# EAGLE schematic przekaznik (EAGLE 7.7.0)
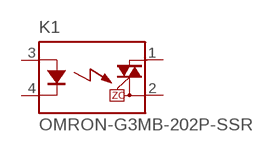
[diagram p0: schematic, sheet 1]

## Parts
K1  OMRON-G3MB-202P-SSR1  [OMRON-G3MB-202P-SSR]
Unconnected: K1.1(DS1) K1.2(DS2) K1.3(A) K1.4(K)

## Library data of the parts
K1 = Omron_G3MB_202p_SSR:OMRON-G3MB-202P-SSR: IT(rms) 8A, Zero Cross type SIP 4pin Triac output SSR Source: http://sharp-world.com/products/device/lineup/data/pdf/datasheet/s102s02_e.pdf; OC_FARNELL: unknown; OC_NEWARK: unknown